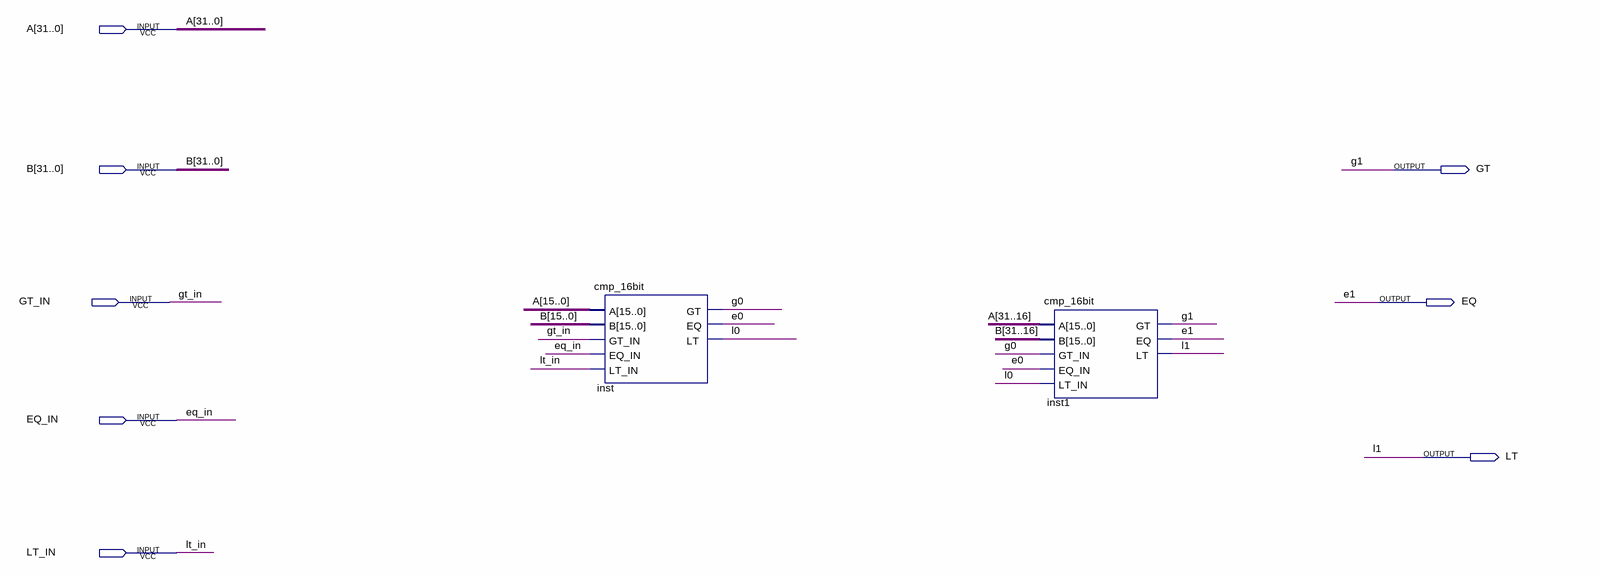
[diagram p0: schematic sheet]
// Quartus schematic cmp_32bit.bdf as structural Verilog: 2 symbols, 8 pins
module cmp_32bit (
  input  [31:0] A,
  input  [31:0] B,
  input  GT_IN,
  input  EQ_IN,
  input  LT_IN,
  output GT,
  output EQ,
  output LT
);

  wire e0, g0, l0;

  cmp_16bit inst (.A(A[15:0]), .B(B[15:0]), .GT_IN(GT_IN), .EQ_IN(EQ_IN), .LT_IN(LT_IN), .GT(g0), .EQ(e0), .LT(l0));
  cmp_16bit inst1 (.A(A[31:16]), .B(B[31:16]), .GT_IN(g0), .EQ_IN(e0), .LT_IN(l0), .GT(GT), .EQ(EQ), .LT(LT));

  // Other names for the same wires on the sheet: e1 = EQ; g1 = GT; l1 = LT
endmodule
